# Altium schematic sheet USB-PORT.SchDoc
size A4; SheetNumber: 4; SheetTotal: 5
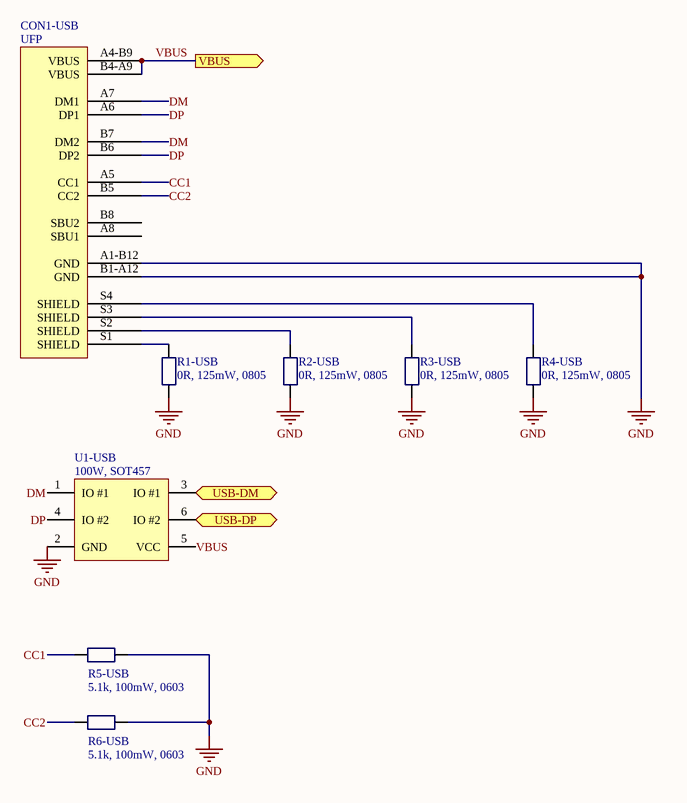
[diagram p0: USB-PORT.SchDoc]

## Parts
CON1-USB  UFP  [Molex USB Type-C]
R1-USB  0R, 125mW, 0805  [0805 [2012]]
R2-USB  0R, 125mW, 0805  [0805 [2012]]
R3-USB  0R, 125mW, 0805  [0805 [2012]]
R4-USB  0R, 125mW, 0805  [0805 [2012]]
R5-USB  5.1k, 100mW, 0603  [0603 [1608]]
R6-USB  5.1k, 100mW, 0603  [0603 [1608]]
U1-USB  100W, SOT457  [SOT457]

## Ports
USB-DM (bidir, see OVERVIEW[1A], MCU[1B]), USB-DP (bidir, see OVERVIEW[1A], MCU[1B]), VBUS (out, see OVERVIEW[2A], POWER[1A])

## Nets
GND: CON1-USB.A1-B12(GND) CON1-USB.B1-A12(GND) R1-USB.2 R2-USB.2 R3-USB.2 R4-USB.2 R5-USB.1 R6-USB.1 U1-USB.2(GND)
CC1: CON1-USB.A5(CC1) R5-USB.2
CC2: CON1-USB.B5(CC2) R6-USB.2
DM: CON1-USB.A7(DM1) CON1-USB.B7(DM2) U1-USB.1(IO_#1)
DP: CON1-USB.A6(DP1) CON1-USB.B6(DP2) U1-USB.4(IO_#2)
USB-DM: U1-USB.3(IO_#1) ; port USB-DM
USB-DP: U1-USB.6(IO_#2) ; port USB-DP
VBUS: CON1-USB.A4-B9(VBUS) CON1-USB.B4-A9(VBUS) U1-USB.5(VCC) ; port VBUS
NetCON1-USB_S1: CON1-USB.S1(SHIELD) R1-USB.1
NetCON1-USB_S2: CON1-USB.S2(SHIELD) R2-USB.1
NetCON1-USB_S3: CON1-USB.S3(SHIELD) R3-USB.1
NetCON1-USB_S4: CON1-USB.S4(SHIELD) R4-USB.1

Not connected (* = marked no-connect by the designer): CON1-USB A8(SBU1) B8(SBU2)

## Library data of the parts
CON1-USB = Molex USB 2.0 Type-C Receptacle: USB Connector, USB Type C, USB 2.0, Receptacle, 16 Ways, Surface Mount, Right Angle; Manufacturer: MOLEX; Manufacturer ID: 216990-0003; Supplier: Farnell; Supplier ID: 3702962; URL: https://ee.farnell.com/molex/216990-0003/conector-usb-2-0-tipo-c-hembra/dp/3702962
R1-USB R2-USB R3-USB R4-USB = Resistor: Manufacturer: MULTICOMP PRO; Manufacturer ID: MC0805S8F0000T5E; Supplier: Farnell; Supplier ID: 2309112; URL: https://ee.farnell.com/multicomp/mc0805s8f0000t5e/res-0r0-1-0-125w-0805-thick-film/dp/2309112
R5-USB R6-USB = Resistor: Manufacturer: YAGEO; Manufacturer ID: RC0603FR-075K1L; Supplier: Farnell; Supplier ID: 3495881; URL: https://ee.farnell.com/yageo/rc0603fr-075k1l/res-5k1-1-0-1w-0603-thick-film/dp/3495881
U1-USB = ESD Protection Device: Manufacturer: NEXPERIA; Manufacturer ID: IP4234CZ6,125; Supplier: Farnell; Supplier ID: 1829276; URL: https://ee.farnell.com/nexperia/ip4234cz6-125/diode-esd-tvs-usb2-0-sot457/dp/1829276